# Altium schematic sheet motor_control.SchDoc
size A4
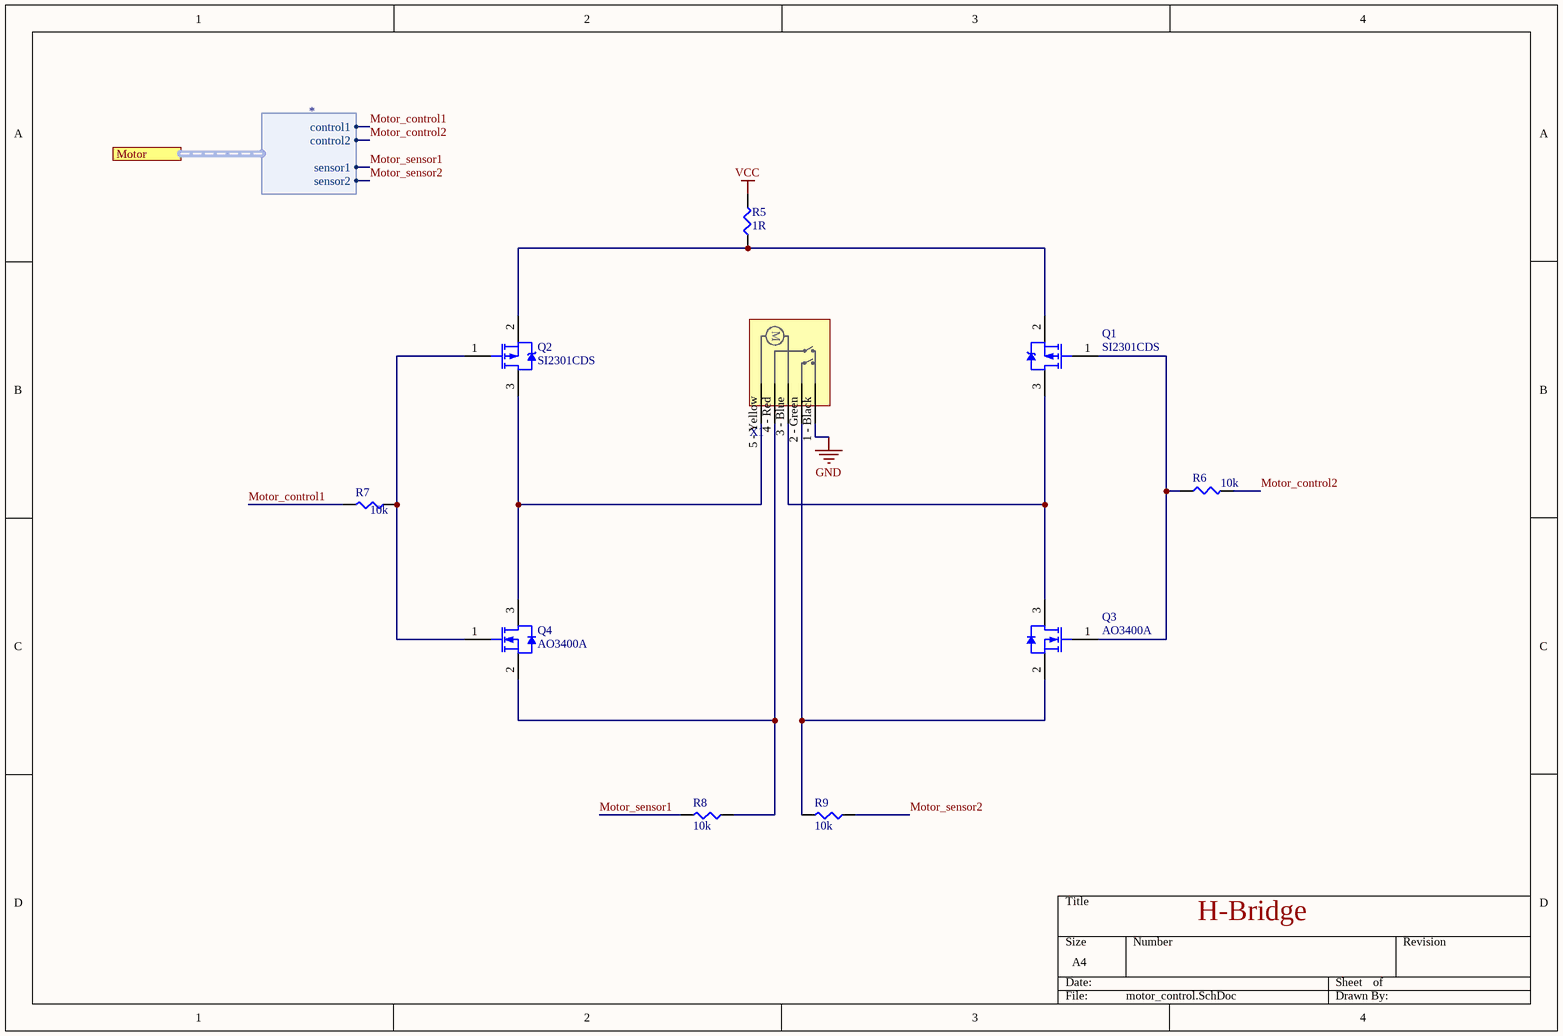
[diagram p0: motor_control.SchDoc]

## Parts
Q1  SI2301CDS  [SOT23-3P95_240X114L20X40N]
Q2  SI2301CDS  [SOT23-3P95_240X114L20X40N]
Q3  AO3400A  [SOT23-3P95_240X114L20X40N]
Q4  AO3400A  [SOT23-3P95_240X114L20X40N]
R5  1R  [RESC200X125X70L40N]
R6  10k  [RESC200X125X70L40N]
R7  10k  [RESC200X125X70L40N]
R8  10k  [RESC200X125X70L40N]
R9  10k  [RESC200X125X70L40N]
X1  motor_connector  [motor_connector]  (value not drawn)

## Ports
Motor (harness *)

## Harnesses
*: control1, control2, sensor1, sensor2

## Nets
GND: X1.1_-_Black
VCC: R5.2
Motor_control1: R7.2 ; port Motor.control1
Motor_control2: R6.2 ; port Motor.control2
Motor_sensor1: R8.2 ; port Motor.sensor1
Motor_sensor2: R9.1 ; port Motor.sensor2
NetQ1_1: Q1.1(G) Q3.1(GATE) R6.1
NetQ1_2: Q1.2(S) Q2.2(S) R5.1
NetQ1_3: Q1.3(D) Q3.3(DRAIN) X1.3_-_Blue
NetQ2_1: Q2.1(G) Q4.1(GATE) R7.1
NetQ2_3: Q2.3(D) Q4.3(DRAIN) X1.5_-_Yellow
NetQ3_2: Q3.2(SOURCE) R9.2 X1.2_-_Green
NetQ4_2: Q4.2(SOURCE) R8.1 X1.4_-_Red

## Notes on the sheet
- H-Bridge
- (in symbol motor_connector) M

## Library data of the parts
Q1 Q2 = P-FET: Alternatives: IRLML2244, IRLML2246, IRLML6401; LCSC Part #: C10487; Part Number: SI2301CDS
Q3 Q4 = N-FET: Alternatives: BSS806N, IRLML6244, IRLML6344; LCSC Part #: C20917; Part Number: AO3400A
R5-R9 = Resistor: Part Number: *
  R5: Value: 1R; LCSC Part #: C25271
  R6-R9: Value: 10k; LCSC Part #: C17414; Package: *